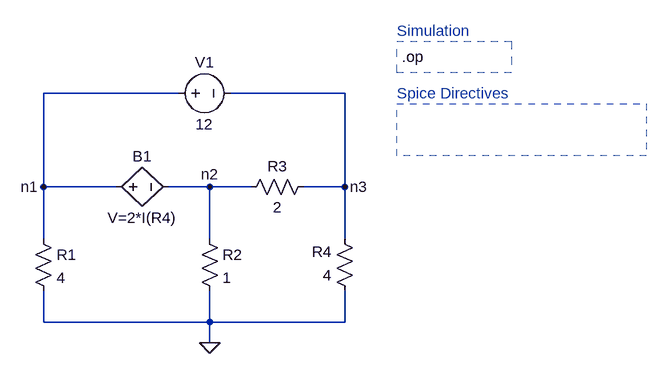
[diagram p0: schematic Example_2_CCVS_bv.asc]
Example_2_CCVS_bv.asc, the LTspice schematic file:
Version 4
SHEET 1 1432 696
WIRE 304 144 96 144
WIRE 560 144 384 144
WIRE 96 288 96 144
WIRE 208 288 96 288
WIRE 352 288 288 288
WIRE 416 288 352 288
WIRE 560 288 560 144
WIRE 560 288 496 288
WIRE 96 368 96 288
WIRE 352 368 352 288
WIRE 560 368 560 288
WIRE 96 496 96 448
WIRE 352 496 352 448
WIRE 352 496 96 496
WIRE 560 496 560 448
WIRE 560 496 352 496
WIRE 352 528 352 496
FLAG 352 528 0
FLAG 96 288 n1
FLAG 352 288 n2
FLAG 560 288 n3
SYMBOL bv 192 288 R270
WINDOW 0 32 56 VTop 2
WINDOW 3 -32 56 VBottom 2
SYMATTR InstName B1
SYMATTR Value V=2*I(R4)
SYMBOL voltage 288 144 R270
WINDOW 0 32 56 VTop 2
WINDOW 3 -32 56 VBottom 2
SYMATTR InstName V1
SYMATTR Value 12
SYMBOL res 80 352 R0
SYMATTR InstName R1
SYMATTR Value 4
SYMBOL res 336 352 R0
SYMATTR InstName R2
SYMATTR Value 1
SYMBOL res 512 272 R90
WINDOW 0 0 56 VBottom 2
WINDOW 3 32 56 VTop 2
SYMATTR InstName R3
SYMATTR Value 2
SYMBOL res 576 464 R180
WINDOW 0 36 76 Left 2
WINDOW 3 36 40 Left 2
SYMATTR InstName R4
SYMATTR Value 4
TEXT 640 48 Left 2 ;Simulation
TEXT 648 88 Left 2 !.op
TEXT 640 144 Left 2 ;Spice Directives
RECTANGLE Normal 816 112 640 64 2
RECTANGLE Normal 1024 240 640 160 2

The netlist it stands for:
* Example_2_CCVS_bv.asc
B1 n1 n2 V=2*I(R4)
V1 n1 n3 12
R1 n1 0 4
R2 n2 0 1
R3 n3 n2 2
R4 0 n3 4
* Simulation
.op
* Spice Directives
.backanno
.end